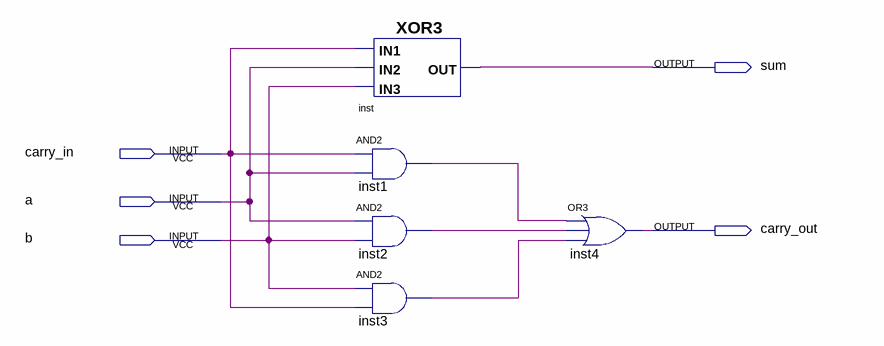
[diagram p0: schematic sheet]
// Quartus schematic f_adder.bdf as structural Verilog: 5 symbols, 5 pins
module f_adder (
  input  carry_in,
  input  a,
  input  b,
  output sum,
  output carry_out
);

  wire inst1_out, inst2_out, inst3_out;

  XOR3 inst (.IN3(b), .IN1(carry_in), .IN2(a), .OUT(sum));
  and inst1 (inst1_out, carry_in, a);
  and inst2 (inst2_out, a, b);
  and inst3 (inst3_out, b, carry_in);
  or inst4 (carry_out, inst1_out, inst2_out, inst3_out);
endmodule
